# Altium schematic sheet Rectifier_shutdown_Gate.SchDoc
size A
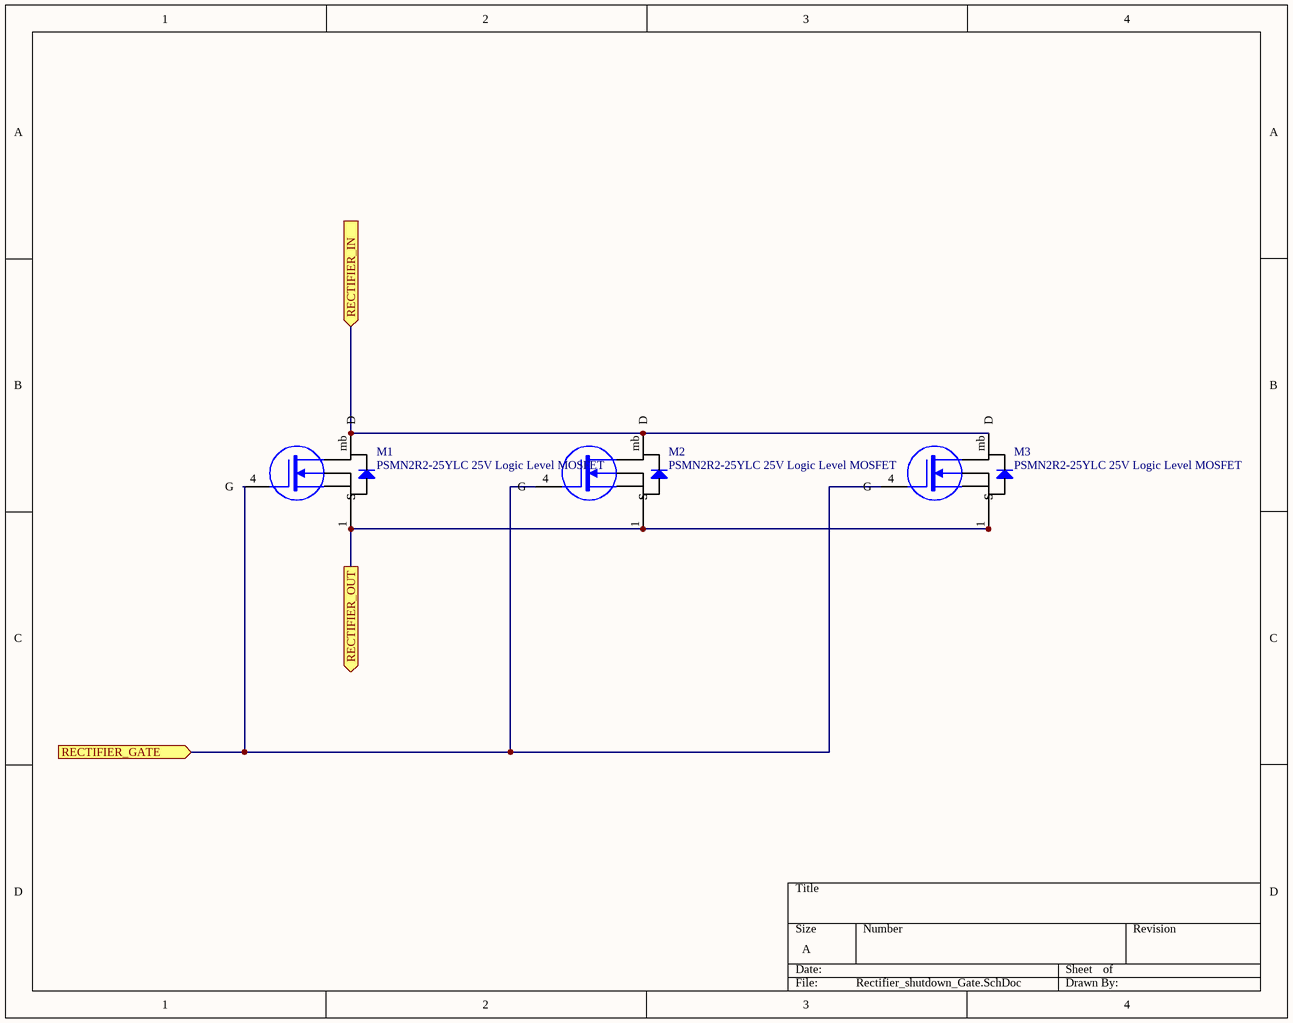
[diagram p0: Rectifier_shutdown_Gate.SchDoc]

## Parts
M1  PSMN2R2-25YLC 25V Logic Level MOSFET  [LFPAK-SO8]
M2  PSMN2R2-25YLC 25V Logic Level MOSFET  [LFPAK-SO8]
M3  PSMN2R2-25YLC 25V Logic Level MOSFET  [LFPAK-SO8]

## Ports
RECTIFIER_GATE (in), RECTIFIER_IN (in), RECTIFIER_OUT (out)

## Nets
RECTIFIER_GATE: M1.4(G) M2.4(G) M3.4(G) ; port RECTIFIER_GATE
RECTIFIER_IN: M1.mb(D) M2.mb(D) M3.mb(D) ; port RECTIFIER_IN
RECTIFIER_OUT: M1.1(S) M1.2(S) M1.3(S) M2.1(S) M2.2(S) M2.3(S) M3.1(S) M3.2(S) M3.3(S) ; port RECTIFIER_OUT

## Library data of the parts
M1-M3 = 3: N-Channel 25V 100A (Tc) 106W (Tc) Surface Mount LFPAK56, Power-SO8; Manufacturer_id: 6; MfrPartNo: PSMN2R2-25YLC,115; idFETs: 3; Drawer_id: 1; Value: N_Channel; Rds_On: 2.5mOhm; Vgs(typ): 10V; Vgs(Max): 20V; Created_By: Nick; Name: PSMN2R2; Vdss: 25V; Num_Circuits: 1; Id: 100A; Package: LFPAK-SO8; Link: https://www.digikey.com/product-detail/en/nexperia-usa-inc/PSMN2R2-25YLC115/1727-5299-1-ND/2674299; ComponentLink1Description: Datasheet; ComponentLink1URL: https://assets.nexperia.com/documents/data-sheet/PSMN2R2-25YLC.pdf; Supplier1: Digi-Key; Supplier1PartNo: 1727-5299-1-ND